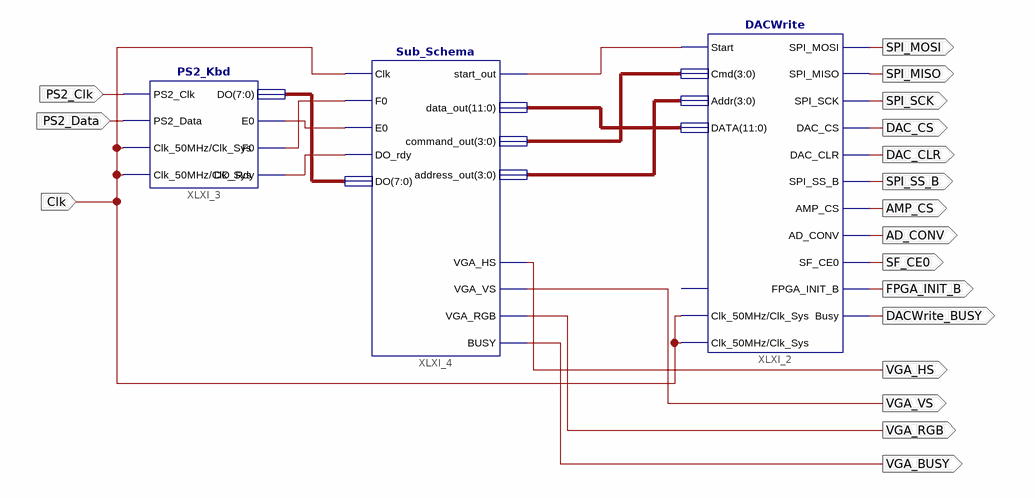
[diagram p0: schematic sheet 1]
// Xilinx ISE schematic Main_Schema.sch (spartan3e) as structural Verilog: 3 symbols, 18 ports
module Main_Schema (
  input  PS2_Clk,
  input  PS2_Data,
  input  Clk,
  output SPI_MOSI,
  output SPI_MISO,
  output SPI_SCK,
  output DAC_CS,
  output DAC_CLR,
  output SPI_SS_B,
  output AMP_CS,
  output AD_CONV,
  output SF_CE0,
  output FPGA_INIT_B,
  output DACWrite_BUSY,
  output VGA_HS,
  output VGA_VS,
  output VGA_RGB,
  output VGA_BUSY
);

  wire XLXN_3, XLXN_4, XLXN_5, XLXN_6;
  wire [3:0] XLXN_8, XLXN_9;
  wire [7:0] XLXN_2;
  wire [11:0] XLXN_7;

  PS2_Kbd XLXI_3 (
    .PS2_Clk(PS2_Clk), .PS2_Data(PS2_Data), .Clk_50MHz(Clk), .E0(XLXN_3), .F0(XLXN_4), .DO_Rdy(XLXN_5),
    .DO(XLXN_2), .Clk_Sys(Clk));
  DACWrite XLXI_2 (
    .Start(XLXN_6), .SPI_MISO(SPI_MISO), .Cmd(XLXN_8), .Addr(XLXN_9), .DATA(XLXN_7), .DAC_CLR(DAC_CLR),
    .DAC_CS(DAC_CS), .SPI_MOSI(SPI_MOSI), .SPI_SCK(SPI_SCK), .SPI_SS_B(SPI_SS_B), .AMP_CS(AMP_CS),
    .AD_CONV(AD_CONV), .SF_CE0(SF_CE0), .FPGA_INIT_B(FPGA_INIT_B), .Busy(DACWrite_BUSY), .Clk_50MHz(Clk),
    .Clk_Sys(Clk));  // open: Reset
  Sub_Schema XLXI_4 (
    .Clk(Clk), .F0(XLXN_4), .DO_rdy(XLXN_5), .DO(XLXN_2), .E0(XLXN_3), .start_out(XLXN_6), .data_out(XLXN_7),
    .command_out(XLXN_8), .address_out(XLXN_9), .VGA_HS(VGA_HS), .VGA_VS(VGA_VS), .VGA_RGB(VGA_RGB),
    .BUSY(VGA_BUSY));
endmodule
